# EAGLE design analyze_remocon (EAGLE 6.3)
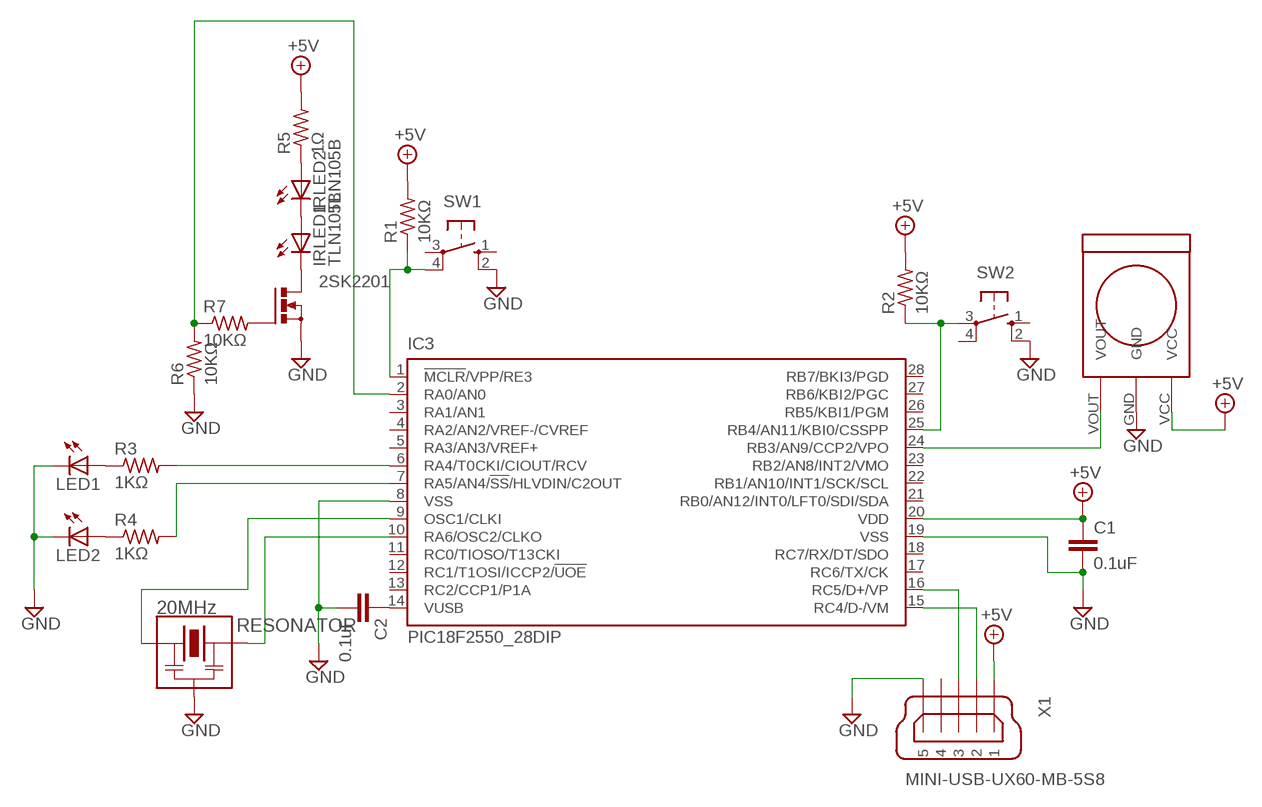
[diagram p0: schematic, sheet 1]

## Parts
2SK2201  BUZ11BV  [TO220BV]
C1  0.1uF  C-EU025-024X044  [C025-024X044]
C2  0.1uF  C-EU025-024X044  [C025-024X044]
IC3  PIC18F2550_28DIP  [DIL28-3]
IRLED1  TLN105B  LED3MM  [LED3MM]
IRLED2  TLN105B  LED3MM  [LED3MM]
LED1  LED3MM  [LED3MM]
LED2  LED3MM  [LED3MM]
PL-IRM2161-C438  IRM2161  [PL-IRM2161-C438]
R1  10KΩ  R-US_MELF0102R  [MINI_MELF-0102R]
R2  10KΩ  R-US_MELF0102R  [MINI_MELF-0102R]
R3  1KΩ  R-US_MELF0102R  [MINI_MELF-0102R]
R4  1KΩ  R-US_MELF0102R  [MINI_MELF-0102R]
R5  1Ω  R-US_0207/7  [0207/7]
R6  10KΩ  R-US_0207/7  [0207/7]
R7  10KΩ  R-US_0207/7  [0207/7]
RESONATOR  20MHz  CRES-HA  [HC-49G]
SW1  10-XX  [B3F-10XX]
SW2  10-XX  [B3F-10XX]
X1  MINI-USB-UX60-MB-5S8  [UX60-MB-5S8]

## Nets
20MHZ: IC3.9(OSC1/CLKI) RESONATOR.P1(LFT)
BLOCK: C1.1 IC3.20(VDD) PL-IRM2161-C438.VCC R1.2 R2.2 R5.2 X1.1 ; supply symbol labelled +5V
GND: 2SK2201.S C1.2 C2.2 IC3.8(VSS) IC3.19(VSS) LED1.K(C) LED2.K(C) PL-IRM2161-C438.GND R6.1 RESONATOR.CENT(GND) SW1.2(S1) SW2.2(S1) X1.5
N$1: IC3.15(RC4/D-/VM) X1.2
N$2: IC3.16(RC5/D+/VP) X1.3
N$3: C2.1 IC3.14(VUSB)
N$4: IC3.1(!MCLR!/VPP/RE3) R1.1 SW1.4(P1)
N$7: IC3.25(RB4/AN11/KBI0/CSSPP) R2.1 SW2.3(P)
N$8: IC3.10(RA6/OSC2/CLKO) RESONATOR.P2(RIT)
N$9: IC3.6(RA4/T0CKI/CIOUT/RCV) R3.2
N$11: LED1.A R3.1
N$12: IC3.7(RA5/AN4/!SS!/HLVDIN/C2OUT) R4.2
N$13: LED2.A R4.1
N$14: IC3.2(RA0/AN0) R6.2 R7.1
N$15: IRLED2.A R5.1
N$16: IRLED1.A IRLED2.K(C)
N$17: 2SK2201.D IRLED1.K(C)
N$18: 2SK2201.G R7.2
N$19: IC3.24(RB3/AN9/CCP2/VPO) PL-IRM2161-C438.VOUT
Unconnected: IC3.3(RA1/AN1) IC3.4(RA2/AN2/VREF-/CVREF) IC3.5(RA3/AN3/VREF+) IC3.11(RC0/TIOSO/T13CKI) IC3.12(RC1/T1OSI/ICCP2/!UOE) IC3.13(RC2/CCP1/P1A) IC3.17(RC6/TX/CK) IC3.18(RC7/RX/DT/SDO) IC3.21(RB0/AN12/INT0/LFT0/SDI/SDA) IC3.22(RB1/AN10/INT1/SCK/SCL) IC3.23(RB2/AN8/INT2/VMO) IC3.26(RB5/KBI1/PGM) IC3.27(RB6/KBI2/PGC) IC3.28(RB7/BKI3/PGD) SW1.1(S) SW1.3(P) SW2.1(S) SW2.4(P1) X1.4

## Library data of the parts
2SK2201 = transistor-power:BUZ11: N-CHANNEL MOS FET
C1 C2 = rcl:C-EU: CAPACITOR, European symbol
IC3 = microchip:PIC18F2*_28: USB Microcontrollers with nanoWatt Technology High-Performance, Enhanced Flash, 28/40/44-Pin, Source: http://ww1.microchip.com/downloads/en/devicedoc/39632c.pdf; MF: MICROCHIP; MPN: PIC18F2550-I/SP; OC_FARNELL: 1523822; OC_NEWARK: 80K6054
IRLED1 IRLED2 LED1 LED2 = led:LED: LED OSRAM: - CHIPLED LG R971, LG N971, LY N971, LG Q971, LY Q971, LO R971, LY R971 LH N974, LH R974 LS Q976, LO Q976, LY Q976 LO Q996 - Hyper CHIPLED LW Q18S LB Q993, LB Q99A, LB R99A - SideLED LS A670, LO A670, LY A670, LG A670, LP A670 LB A673, LV A673, LT A673, LW A673 LH A674 LY A675 LS A676, LA A676, LO A676, LY A676, LW A676 LS A679, LY A679, LG A679 - Hyper Micro SIDELED® LS Y876, LA Y876, LO Y876, LY Y876 LT Y87S - SmartLED LW L88C, LW L88S LB L89C, LB L89S, LG L890 LS L89K, LO L89K, LY L89K LS L896, LA L896, LO L896, LY L896 - TOPLED LS T670, LO T670, LY T670, LG T670, LP T670 LSG T670, LSP T670, LSY T670, LOP T670, LYG T670 LG T671, LOG T671, LSG T671 LB T673, LV T673, LT T673, LW T673 LH T674 LS T676, LA T676, LO T676, LY T676, LB T676, LH T676, LSB T676, LW T676 LB T67C, LV T67C, LT T67C, LS T67K, LO T67K, LY T67K, LW E67C LS E67B, LA E67B, LO E67B, LY E67B, LB E67C, LV E67C, LT E67C LW T67C LS T679, LY T679, LG T679 LS T770, LO T770, LY T770, LG T770, LP T770 LB T773, LV T773, LT T773, LW T773 LH T774 LS E675, LA E675, LY E675, LS T675 LS T776, LA T776, LO T776, LY T776, LB T776 LHGB T686 LT T68C, LB T68C - Hyper Mini TOPLED® LB M676 - Mini TOPLED Santana® LG M470 LS M47K, LO M47K, LY M47K Source: http://www.osram.convergy.de LUXEON: - LUMILED® LXK2-PW12-R00, LXK2-PW12-S00, LXK2-PW14-U00, LXK2-PW14-V00 LXK2-PM12-R00, LXK2-PM12-S00, LXK2-PM14-U00 LXK2-PE12-Q00, LXK2-PE12-R00, LXK2-PE12-S00, LXK2-PE14-T00, LXK2-PE14-U00 LXK2-PB12-K00, LXK2-PB12-L00, LXK2-PB12-M00, LXK2-PB14-N00, LXK2-PB14-P00, LXK2-PB14-Q00 LXK2-PR12-L00, LXK2-PR12-M00, LXK2-PR14-Q00, LXK2-PR14-R00 LXK2-PD12-Q00, LXK2-PD12-R00, LXK2-PD12-S00 LXK2-PH12-R00, LXK2-PH12-S00 LXK2-PL12-P00, LXK2-PL12-Q00, LXK2-PL12-R00 Source: www.luxeon.com KINGBRIGHT: KA-3528ASYC Source: www.kingbright.com
PL-IRM2161-C438 = IRM2161:IRM2161: PL-IRM2161-C438 from maritex.com.pl by Grzegorz Rajtar mcgregor@blackmesaeast.com.pl
R1-R7 = rcl:R-US_: RESISTOR, American symbol
RESONATOR = xtal:CRES-H: Ceramic resonator, built in caps
SW1 SW2 = switch-omron:10-XX: OMRON SWITCH; MPN: B3F-1000; OC_FARNELL: 176432; OC_NEWARK: 36M3542
X1 = con-hirose:MINI-USB-: MINI USB Connector Source: http://www.hirose.co.jp/cataloge_hp/e24000019.pdf; OC_FARNELL: unknown; OC_NEWARK: unknown

## Board
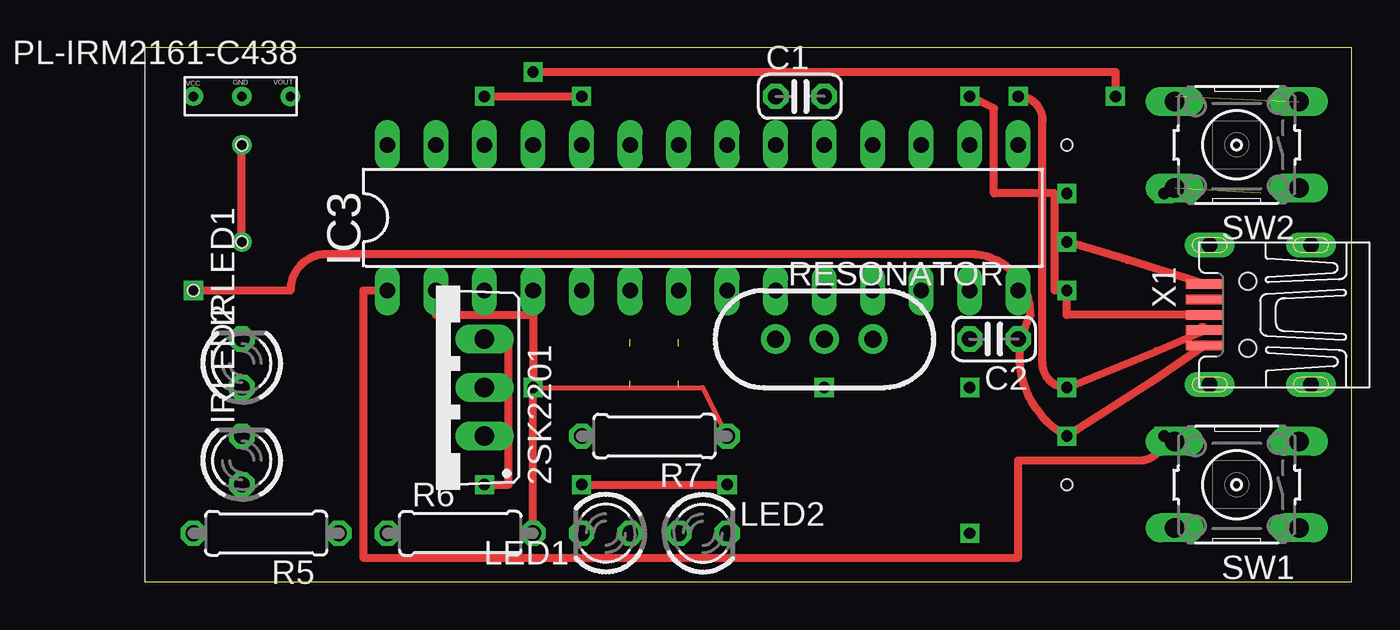
[diagram p1: board, top side]
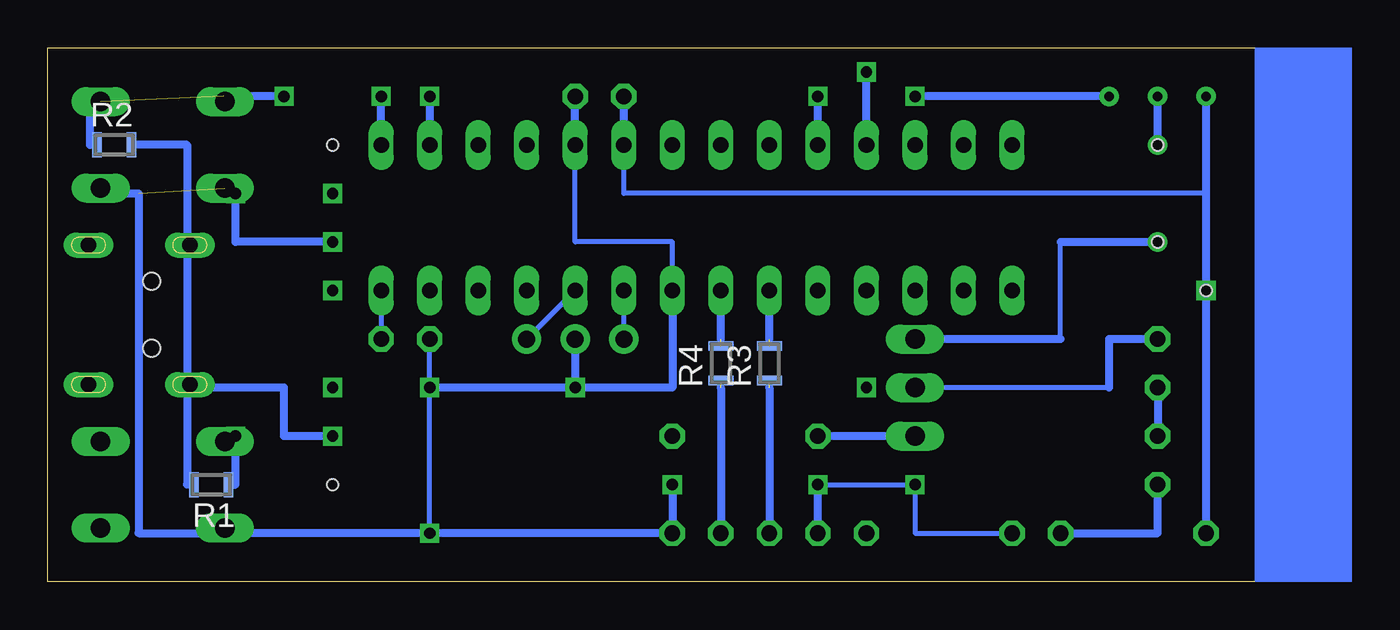
[diagram p2: board, bottom side, seen from below]

Size 63.17 x 27.93 mm. Coordinates in mm from the lower left corner, seen from the top.
Outline: 0,0 63.17,0 63.17,27.93 0,27.93
Copper layers (1*16): Top 0.035mm / dielectric 1.5mm / Bottom 0.035mm
Design rules "default": minimum track width 10mil, minimum drill 24mil, track to track 8mil, track to pad 8mil, pad to pad 8mil, via to via 8mil, smd to smd 8mil, copper to edge 40mil, drill to drill 8mil, minimum pad ring 10mil, minimum via ring 8mil, stop-mask expansion 4mil, vias tented up to drill 0mil, thermal gap 10mil
Holes 0.6 mm at 5.08,17.78 5.08,22.86 2.54,15.24 48.26,22.86 48.26,5.08
tRestrict: area 12.1,17.1 to 46.4,21; area 7,4.4 to 14.6,13.3; area 31.8,13.3 to 38.7,14; area 31.8,9.5 to 39.4,10.8

### Footprints (pad centres in the part's own frame; a part is rotated, then mirrored left to right if it is on the bottom)
TO220BV = drill 1.016 long: D 0,-2.54; G -2.54,-2.54; S 2.54,-2.54
C025-024X044 = drill 0.813 octagon: 1 -1.27,0; 2 1.27,0
DIL28-3 = drill 0.813 long: 1 -16.51,-3.81; 2 -13.97,-3.81; 3 -11.43,-3.81; 4 -8.89,-3.81; 5 -6.35,-3.81; 6 -3.81,-3.81; 7 -1.27,-3.81; 8 1.27,-3.81; 9 3.81,-3.81; 10 6.35,-3.81; 11 8.89,-3.81; 12 11.43,-3.81; 13 13.97,-3.81; 14 16.51,-3.81; 15 16.51,3.81; 16 13.97,3.81; 17 11.43,3.81; 18 8.89,3.81; 19 6.35,3.81; 20 3.81,3.81; 21 1.27,3.81; 22 -1.27,3.81; 23 -3.81,3.81; 24 -6.35,3.81; 25 -8.89,3.81; 26 -11.43,3.81; 27 -13.97,3.81; 28 -16.51,3.81
LED3MM = drill 0.813 octagon: A -1.27,0; K 1.27,0
PL-IRM2161-C438 = drill 0.5 pad 0.813: GND 2.54,0; VCC 5.08,0; VOUT 0,0.01
MINI_MELF-0102R = smd 0.5 x 1.3: 1 -0.9,0; 2 0.9,0
0207/7 = drill 0.813 octagon: 1 -3.81,0; 2 3.81,0
HC-49G = drill 0.889 pad 1.524: CENT 0,0; P1 -2.54,0; P2 2.54,0
B3F-10XX = drill 1.016 long: 1 -3.251,2.261; 2 3.251,2.261; 3 -3.251,-2.261; 4 3.251,-2.261
UX60-MB-5S8 = smd 2 x 0.5: 1 8.65,1.6; 2 8.65,0.8; 3 8.65,0; 4 8.65,-0.8; 5 8.65,-1.6 | drill 0.8 long: M1 3.1,-3.65; M2 3.1,3.65; M3 8.4,3.65; M4 8.4,-3.65 | hole 0.9: 6.4,-1.75; 6.4,1.75

### Placement (x,y rotation side)
2SK2201  15.24,10.16 90 top
C1  34.29,25.4 0 top
C2  44.45,12.7 180 top
IC3  29.21,19.05 0 top
IRLED1  5.08,11.43 90 top
IRLED2  5.08,6.35 90 top
LED1  24.13,2.54 180 top
LED2  29.21,2.54 0 top
PL-IRM2161-C438  7.62,25.4 180 top
R1  54.61,5.08 180 bottom
R2  59.69,22.86 0 bottom
R3  25.4,11.43 90 bottom
R4  27.94,11.43 90 bottom
R5  6.35,2.54 180 top
R6  16.51,2.54 0 top
R7  26.67,7.62 180 top
RESONATOR  35.56,12.7 0 top
SW1  57.15,5.08 180 top
SW2  57.15,22.86 180 top
X1  64.14,13.97 180 top

### Tracks (layer width: path | path; a pad name or v marks a point on that pad's centre or on a via)
20MHZ
  Bottom 0.254: RESONATOR.P1 IC3.9
BLOCK  (via drill 0.6)
  Top 0.406: X1.1 52.7,10.46 v48.26,7.62 arc-90 46.35,13.97 arc90 43.18,17.14 9.53,17.14 arc90 7.62,15.24 v2.54,15.24
  Bottom 0.254: IC3.20 33.02,20.32 2.54,20.32
  Bottom 0.406: v48.26,7.62 50.8,7.62 50.8,10.16 55.88,10.16 | 55.88,10.16 55.88,22.86 R2.2 | 55.88,10.16 55.88,5.08 R1.2 | R5.2 v2.54,15.24 2.54,20.32 PL-IRM2161-C438.VCC | IC3.20 C1.1
GND  (via drill 0.6, 0.61)  (1 unrouted)
  Top 0.406: v5.08,17.78 v5.08,22.86 | v22.86,5.08 v30.48,5.08 | v17.78,5.08 19.05,5.08 19.05,12.7 2SK2201.S | X1.5 51.44,16.84 v48.26,17.78
  Bottom 0.254: IC3.19 35.56,17.78 30.48,17.78 IC3.8 | 10.16,12.7 10.16,17.78 | v43.18,2.54 v43.18,10.16 C2.2 | R6.1 17.78,2.54 v17.78,5.08 v22.86,5.08 | v53.34,20.32 SW2.2
  Bottom 0.406: 10.16,12.7 2SK2201.S | 10.16,17.78 v5.08,17.78 | v5.08,22.86 PL-IRM2161-C438.GND | LED1.K v22.86,5.08 | v30.48,5.08 LED2.K v43.18,2.54 53.34,2.54 | RESONATOR.CENT v35.56,10.16 | v35.56,10.16 v43.18,10.16 | IC3.8 30.48,10.16 v35.56,10.16 | SW1.2 53.34,2.82 53.34,2.54 | 60.96,20.32 58.42,20.32 58.42,2.54 53.34,2.54 | IC3.19 C1.2 | v48.26,17.78 53.34,17.78 v53.34,20.32
N$1  (via drill 0.6)
  Top 0.406: v45.72,25.4 arc-90 46.99,24.13 46.99,11.43 arc90 v48.26,10.16 52.95,12.06 X1.2 arc90 55.32,13.34
  Bottom 0.406: IC3.15 v45.72,25.4
N$2  (via drill 0.6)
  Top 0.406: X1.3 48.26,13.97 48.26,15.24 47.62,15.24 47.62,20.32 44.45,20.32 44.45,24.77 v43.18,25.4
  Bottom 0.406: v43.18,25.4 IC3.16
N$3
  Bottom 0.254: IC3.14 C2.1
N$4  (via drill 0.6)
  Top 0.406: v53.34,7.62 arc-90 52.07,6.35 45.72,6.35 45.72,1.27 11.43,1.27 11.43,15.24 IC3.1
  Bottom 0.406: R1.1 53.34,5.08 v53.34,7.62 arc90 53.62,7.34 SW1.4
N$5  (via drill 0.6)
  other vias: 48.26,15.24
N$6  (via drill 0.6)
  other vias: 48.26,20.32
N$7  (via drill 0.6)  (1 unrouted)
  Top 0.406: v20.32,26.67 50.8,26.67 v50.8,25.4
  Bottom 0.254: 60.96,25.4 SW2.3
  Bottom 0.406: IC3.25 v20.32,26.67 | R2.1 60.96,22.86 60.96,25.4 | v50.8,25.4 53.98,25.4 53.98,24.77
N$8
  Bottom 0.254: RESONATOR.P2 IC3.10
N$9  (1 unrouted)
  Bottom 0.406: 25.4,12.7 IC3.6
N$11  (1 unrouted)
  Bottom 0.406: 25.4,10.16 LED1.A
N$12  (1 unrouted)
  Bottom 0.406: 27.94,12.7 IC3.7
N$13  (1 unrouted)
  Bottom 0.406: 27.94,10.16 LED2.A
N$14  (via drill 0.6)
  Top 0.254: R7.1 29.21,10.16 v20.32,10.16
  Top 0.406: R6.2 v20.32,10.16 20.32,13.97 15.24,13.97 IC3.2
N$15
  Bottom 0.406: R5.1 5.08,2.54 IRLED2.A
N$16
  Bottom 0.406: IRLED1.A IRLED2.K
N$17
  Bottom 0.254: 7.62,10.16 2SK2201.D
  Bottom 0.406: IRLED1.K 7.62,12.7 7.62,10.16
N$18
  Bottom 0.406: 2SK2201.G R7.2
N$19  (via drill 0.6)
  Top 0.406: v17.78,25.4 v22.86,25.4
  Bottom 0.254: PL-IRM2161-C438.VOUT
  Bottom 0.406: PL-IRM2161-C438.VOUT v17.78,25.4 | IC3.24 v22.86,25.4
(copper drawn outside any net)
  shapes: Bottom area x1